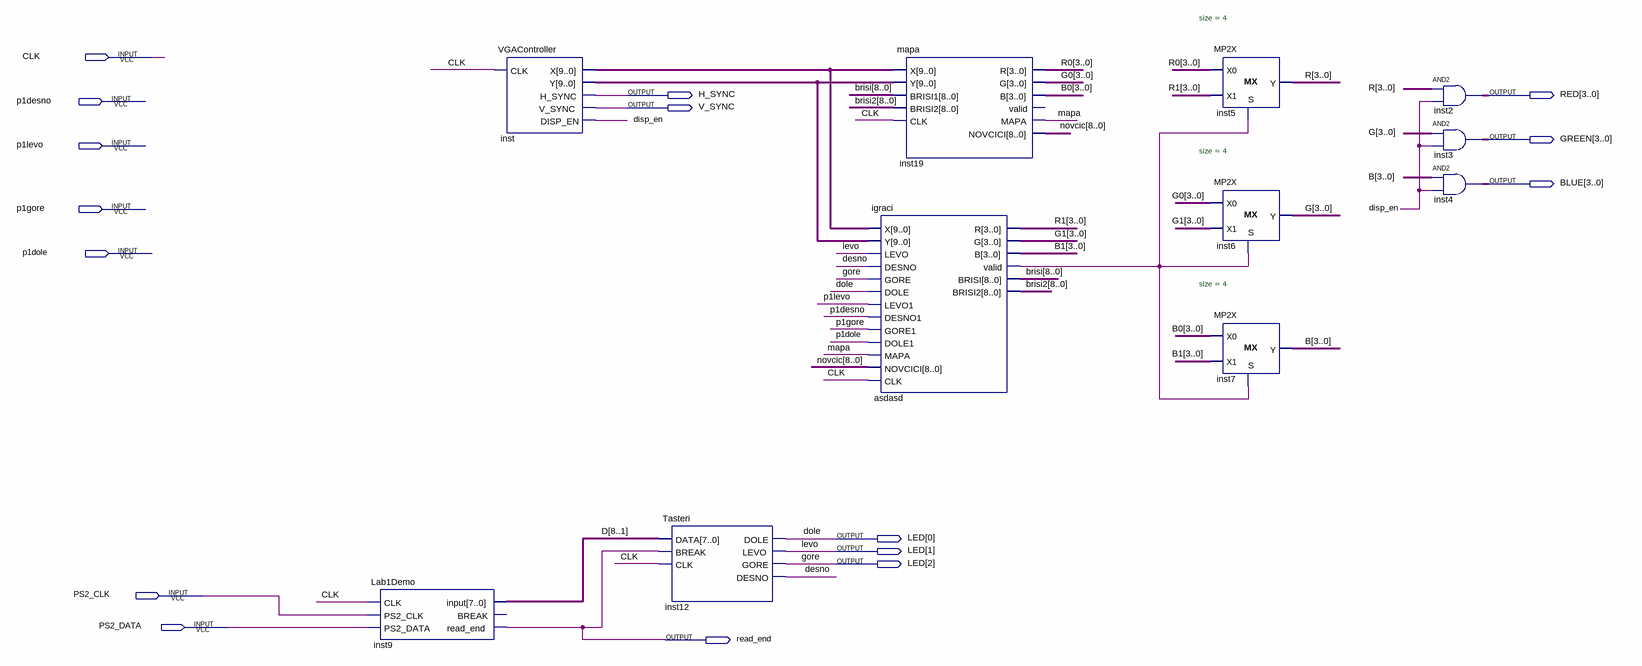
[diagram p0: schematic sheet]
// Quartus schematic main.bdf as structural Verilog: 11 symbols, 16 pins
module main (
  input  CLK,
  input  p1desno,
  input  p1levo,
  input  p1gore,
  input  p1dole,
  input  PS2_CLK,
  input  PS2_DATA,
  output H_SYNC,
  output [3:0] RED,
  output V_SYNC,
  output [3:0] GREEN,
  output [3:0] BLUE,
  output [2:0] LED,
  output read_end
);

  wire asdasd_valid, desno, disp_en, mapa;
  wire [3:0] B, B0, B1, G, G0, G1, R, R0, R1;
  wire [8:0] brisi, brisi2, novcic;
  wire [8:1] D;
  wire [9:0] inst_x, inst_y;

  Lab1Demo inst9 (.CLK(CLK), .PS2_CLK(PS2_CLK), .PS2_DATA(PS2_DATA), .\input (D), .read_end(read_end));  // open: BREAK
  VGAController inst (.CLK(CLK), .X(inst_x), .Y(inst_y), .H_SYNC(H_SYNC), .V_SYNC(V_SYNC), .DISP_EN(disp_en));
  Tasteri inst12 (.DATA(D), .BREAK(read_end), .CLK(CLK), .DOLE(LED[0]), .LEVO(LED[1]), .GORE(LED[2]), .DESNO(desno));
  igraci asdasd (
    .X(inst_x), .Y(inst_y), .LEVO(LED[1]), .DESNO(desno), .GORE(LED[2]), .DOLE(LED[0]), .LEVO1(p1levo),
    .DESNO1(p1desno), .GORE1(p1gore), .DOLE1(p1dole), .MAPA(mapa), .NOVCICI(novcic), .CLK(CLK), .R(R1),
    .G(G1), .B(B1), .valid(asdasd_valid), .BRISI(brisi), .BRISI2(brisi2));
  mapa inst19 (
    .X(inst_x), .Y(inst_y), .BRISI1(brisi), .BRISI2(brisi2), .CLK(CLK), .R(R0), .G(G0), .B(B0), .MAPA(mapa),
    .NOVCICI(novcic));  // open: valid
  MP2X #(.size(4)) inst5 (.S(asdasd_valid), .X0(R0), .X1(R1), .Y(R));
  MP2X #(.size(4)) inst6 (.S(asdasd_valid), .X0(G0), .X1(G1), .Y(G));
  MP2X #(.size(4)) inst7 (.S(asdasd_valid), .X0(B0), .X1(B1), .Y(B));
  assign RED = R & {4{disp_en}};  // AND2 inst2, 4 bits wide
  assign GREEN = G & {4{disp_en}};  // AND2 inst3, 4 bits wide
  assign BLUE = B & {4{disp_en}};  // AND2 inst4, 4 bits wide

  // Other names for the same wires on the sheet: dole = LED[0]; gore = LED[2]; levo = LED[1]
endmodule
